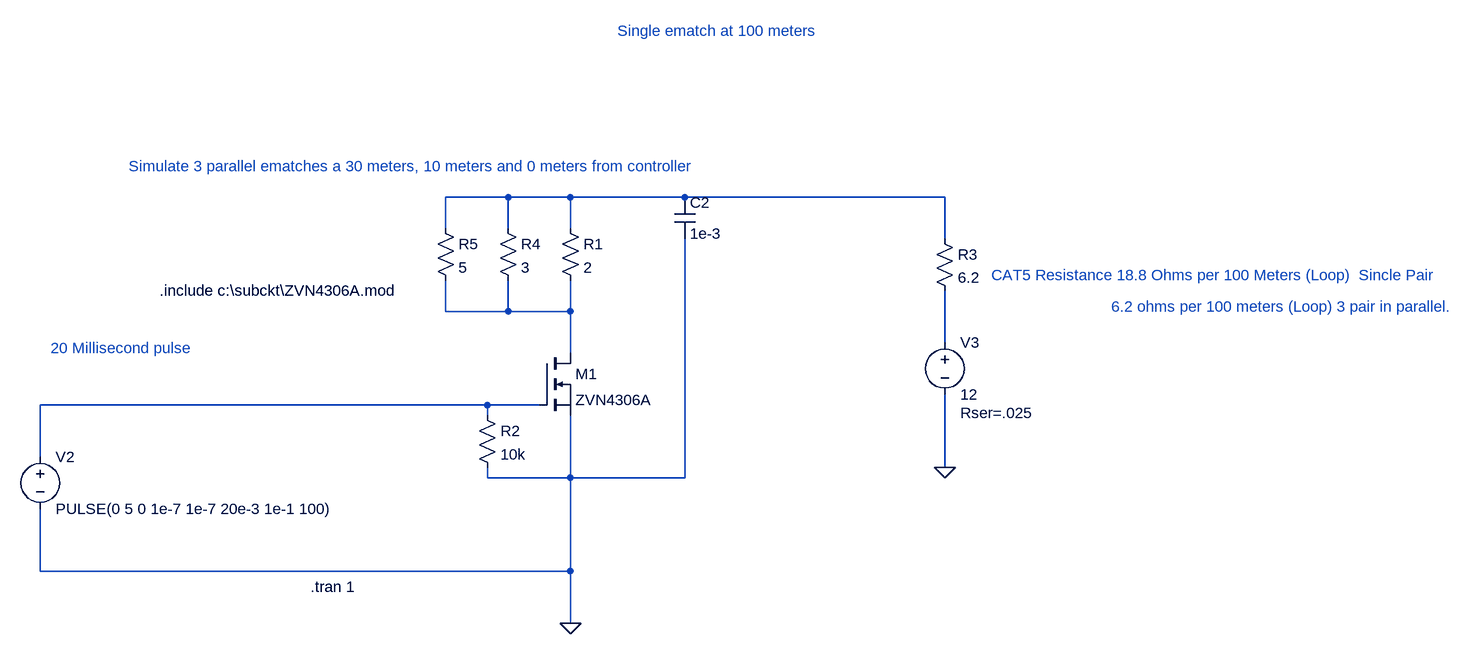
[diagram p0: schematic 1 ematch , 100 meters.asc]
1 ematch , 100 meters.asc, the LTspice schematic file:
Version 4
SHEET 1 1624 900
WIRE 64 -96 -32 -96
WIRE 160 -96 64 -96
WIRE 336 -96 160 -96
WIRE 736 -96 336 -96
WIRE -32 -48 -32 -96
WIRE 64 -48 64 -96
WIRE 160 -48 160 -96
WIRE 736 -32 736 -96
WIRE -32 80 -32 32
WIRE 64 80 64 32
WIRE 64 80 -32 80
WIRE 160 80 160 32
WIRE 160 80 64 80
WIRE 736 128 736 48
WIRE 160 144 160 80
WIRE 32 224 -656 224
WIRE 112 224 32 224
WIRE 32 240 32 224
WIRE -656 304 -656 224
WIRE 736 320 736 208
WIRE 32 336 32 320
WIRE 160 336 160 240
WIRE 160 336 32 336
WIRE 336 336 336 -32
WIRE 336 336 160 336
WIRE -656 480 -656 384
WIRE 160 480 160 336
WIRE 160 480 -656 480
WIRE 160 560 160 480
FLAG 160 560 0
FLAG 736 320 0
SYMBOL nmos 112 144 R0
SYMATTR InstName M1
SYMATTR Value ZVN4306A
SYMATTR Prefix X
SYMBOL res 144 -64 R0
SYMATTR InstName R1
SYMATTR Value 2
SYMBOL res 16 224 R0
SYMATTR InstName R2
SYMATTR Value 10k
SYMBOL voltage -656 288 R0
WINDOW 123 0 0 Left 2
WINDOW 39 24 124 Left 2
SYMATTR InstName V2
SYMATTR Value PULSE(0 5 0 1e-7 1e-7 20e-3 1e-1 100)
SYMBOL voltage 736 112 R0
WINDOW 123 0 0 Left 2
WINDOW 39 24 124 Left 2
SYMATTR SpiceLine Rser=.025
SYMATTR InstName V3
SYMATTR Value 12
SYMBOL cap 320 -96 R0
SYMATTR InstName C2
SYMATTR Value 1e-3
SYMBOL res 720 -48 R0
SYMATTR InstName R3
SYMATTR Value 6.2
SYMBOL res 48 -64 R0
SYMATTR InstName R4
SYMATTR Value 3
SYMBOL res -48 -64 R0
SYMATTR InstName R5
SYMATTR Value 5
TEXT -240 504 Left 2 !.tran 1
TEXT 232 -352 Left 2 ;Single ematch at 100 meters
TEXT -472 48 Left 2 !.include c:\\subckt\\ZVN4306A.mod
TEXT 808 24 Left 2 ;CAT5 Resistance 18.8 Ohms per 100 Meters (Loop)  Sincle Pair
TEXT 992 72 Left 2 ;6.2 ohms per 100 meters (Loop) 3 pair in parallel.
TEXT -640 136 Left 2 ;20 Millisecond pulse
TEXT -520 -144 Left 2 ;Simulate 3 parallel ematches a 30 meters, 10 meters and 0 meters from controller

The netlist it stands for:
* 1 ematch , 100 meters.asc
XM1 N002 N004 0 ZVN4306A  ; pins D G S
R1 N001 N002 2
R2 N004 0 10k
V2 N004 0 PULSE(0 5 0 1e-7 1e-7 20e-3 1e-1 100)
V3 N003 0 12 Rser=.025
C2 N001 0 1e-3
R3 N001 N003 6.2
R4 N001 N002 3
R5 N001 N002 5
.tran 1
* Single ematch at 100 meters
.include c:\subckt\ZVN4306A.mod
* CAT5 Resistance 18.8 Ohms per 100 Meters (Loop)  Sincle Pair
* 6.2 ohms per 100 meters (Loop) 3 pair in parallel.
* 20 Millisecond pulse
* Simulate 3 parallel ematches a 30 meters, 10 meters and 0 meters from controller
.backanno
.end